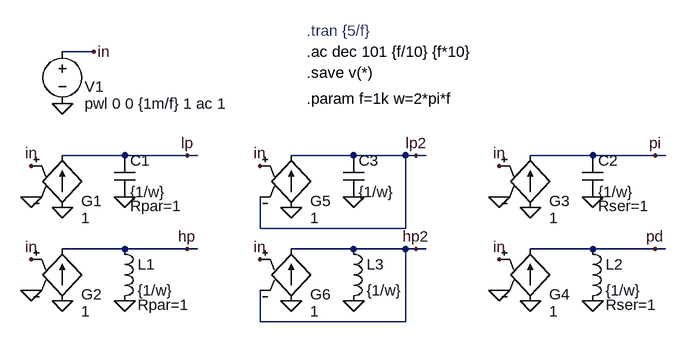
[diagram p0: schematic 1st_lp,hp,pi,pd.asc]
1st_lp,hp,pi,pd.asc, the LTspice schematic file:
Version 4
SHEET 1 1052 680
WIRE 160 -16 112 -16
WIRE 208 144 112 144
WIRE 304 144 208 144
WIRE 320 144 304 144
WIRE 560 144 464 144
WIRE 640 144 560 144
WIRE 656 144 640 144
WIRE 672 144 656 144
WIRE 928 144 832 144
WIRE 1024 144 928 144
WIRE 1040 144 1024 144
WIRE 416 256 416 208
WIRE 640 256 640 144
WIRE 640 256 416 256
WIRE 208 288 112 288
WIRE 304 288 208 288
WIRE 320 288 304 288
WIRE 560 288 464 288
WIRE 640 288 560 288
WIRE 656 288 640 288
WIRE 672 288 656 288
WIRE 928 288 832 288
WIRE 1024 288 928 288
WIRE 1040 288 1024 288
WIRE 416 400 416 352
WIRE 640 400 640 288
WIRE 640 400 416 400
FLAG 304 144 lp
FLAG 208 208 0
FLAG 112 224 0
FLAG 64 208 0
FLAG 112 64 0
FLAG 304 288 hp
FLAG 208 368 0
FLAG 112 368 0
FLAG 64 352 0
FLAG 160 -16 in
FLAG 1024 144 pi
FLAG 928 208 0
FLAG 832 224 0
FLAG 1024 288 pd
FLAG 928 368 0
FLAG 832 368 0
FLAG 64 160 in
FLAG 64 304 in
FLAG 784 208 0
FLAG 784 352 0
FLAG 784 160 in
FLAG 784 304 in
FLAG 656 144 lp2
FLAG 560 208 0
FLAG 464 224 0
FLAG 656 288 hp2
FLAG 560 368 0
FLAG 464 368 0
FLAG 416 160 in
FLAG 416 304 in
SYMBOL g 112 128 R0
WINDOW 0 29 86 Left 2
WINDOW 3 29 112 Left 2
SYMATTR InstName G1
SYMATTR Value 1
SYMBOL cap 192 144 R0
WINDOW 123 24 78 Left 2
SYMATTR Value2 Rpar=1
SYMATTR InstName C1
SYMATTR Value {1/w}
SYMBOL voltage 112 -32 R0
WINDOW 0 34 70 Left 2
WINDOW 3 34 96 Left 2
SYMATTR InstName V1
SYMATTR Value pwl 0 0 {1m/f} 1 ac 1
SYMBOL g 112 272 R0
WINDOW 0 29 86 Left 2
WINDOW 3 29 112 Left 2
SYMATTR InstName G2
SYMATTR Value 1
SYMBOL ind 192 272 R0
WINDOW 123 36 102 Left 2
SYMATTR Value2 Rpar=1
SYMATTR InstName L1
SYMATTR Value {1/w}
SYMATTR SpiceLine Rser=0
SYMBOL g 832 128 R0
WINDOW 0 29 86 Left 2
WINDOW 3 29 112 Left 2
SYMATTR InstName G3
SYMATTR Value 1
SYMBOL cap 912 144 R0
WINDOW 123 24 78 Left 2
SYMATTR Value2 Rser=1
SYMATTR InstName C2
SYMATTR Value {1/w}
SYMATTR SpiceLine Rpar=1g
SYMBOL g 832 272 R0
WINDOW 0 29 86 Left 2
WINDOW 3 29 112 Left 2
SYMATTR InstName G4
SYMATTR Value 1
SYMBOL ind 912 272 R0
WINDOW 123 36 102 Left 2
SYMATTR Value2 Rser=1
SYMATTR InstName L2
SYMATTR Value {1/w}
SYMBOL g 464 128 R0
WINDOW 0 29 86 Left 2
WINDOW 3 29 112 Left 2
SYMATTR InstName G5
SYMATTR Value 1
SYMBOL cap 544 144 R0
SYMATTR Value2 Rpar=1g
SYMATTR InstName C3
SYMATTR Value {1/w}
SYMBOL g 464 272 R0
WINDOW 0 29 86 Left 2
WINDOW 3 29 112 Left 2
SYMATTR InstName G6
SYMATTR Value 1
SYMBOL ind 544 272 R0
WINDOW 123 36 102 Left 2
SYMATTR InstName L3
SYMATTR Value {1/w}
SYMATTR SpiceLine Rser=0
TEXT 488 56 Left 2 !.param f=1k w=2*pi*f
TEXT 488 -16 Left 2 !.ac dec 101 {f/10} {f*10}
TEXT 488 -48 Left 2 ;.tran {5/f}
TEXT 488 16 Left 2 !.save v(*)

The netlist it stands for:
* 1st_lp,hp,pi,pd.asc
G1 0 lp in 0 1
C1 lp 0 {1/w} Rpar=1
V1 in 0 pwl 0 0 {1m/f} 1 ac 1
G2 0 hp in 0 1
L1 hp 0 {1/w} Rpar=1 Rser=0
G3 0 pi in 0 1
C2 pi 0 {1/w} Rser=1 Rpar=1g
G4 0 pd in 0 1
L2 pd 0 {1/w} Rser=1
G5 0 lp2 in lp2 1
C3 lp2 0 {1/w} Rpar=1g
G6 0 hp2 in hp2 1
L3 hp2 0 {1/w} Rser=0
.param f=1k w=2*pi*f
.ac dec 101 {f/10} {f*10}
* .tran {5/f}
.save v(*)
.backanno
.end